# Altium schematic sheet Sheet1.SchDoc
size A4
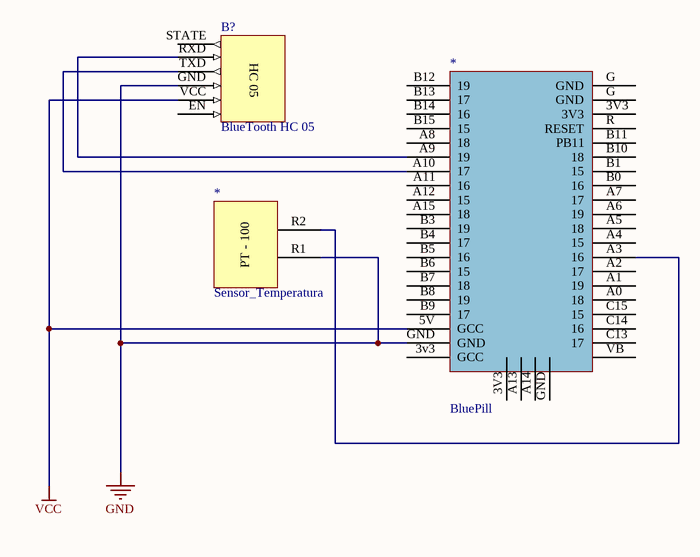
[diagram p0: Sheet1.SchDoc]

## Parts
(Parts that share a designator on the sheet are numbered #1, #2 ... from top to bottom, then left to right.)
*#1  BluePill
*#2  Sensor_Temperatura
B?  BlueTooth HC 05

## Nets
GND: *#1.GND *#2.R1 B?.GND
VCC: *#1.5V(GCC) B?.VCC
Net*#1_A3: *#1.A3(16) *#2.R2
Net*#1_A9: *#1.A9(19) B?.RXD
Net*#1_A10: *#1.A10(17) B?.TXD

Not connected (* = marked no-connect by the designer): *#1 3v3(GCC) 3V3 A0(18) A1(19) A2(17) A4(15) A5(18) A6(19) A7(17) A8(18) A11(16) A12(15) A13(VB) A14(VB) A15(18) B0(16) B1(15) B3(19) B4(17) B5(16) B6(15) B7(18) B8(19) B9(17) B10(18) B11(PB11) B12(19) B13(17) B14(16) B15(15) C13(17) C14(16) C15(15) G(GND) R(RESET) VB(VBAT); B? EN(2) STATE(1)

## Notes on the sheet
- (in symbol BlueTooth) HC 05
- (in symbol Sensor_Temperatura) PT - 100

## Library data of the parts
B? = BlueTooth